# Altium schematic sheet NCS_Wireless_Indicator_leds.SchDoc
size A
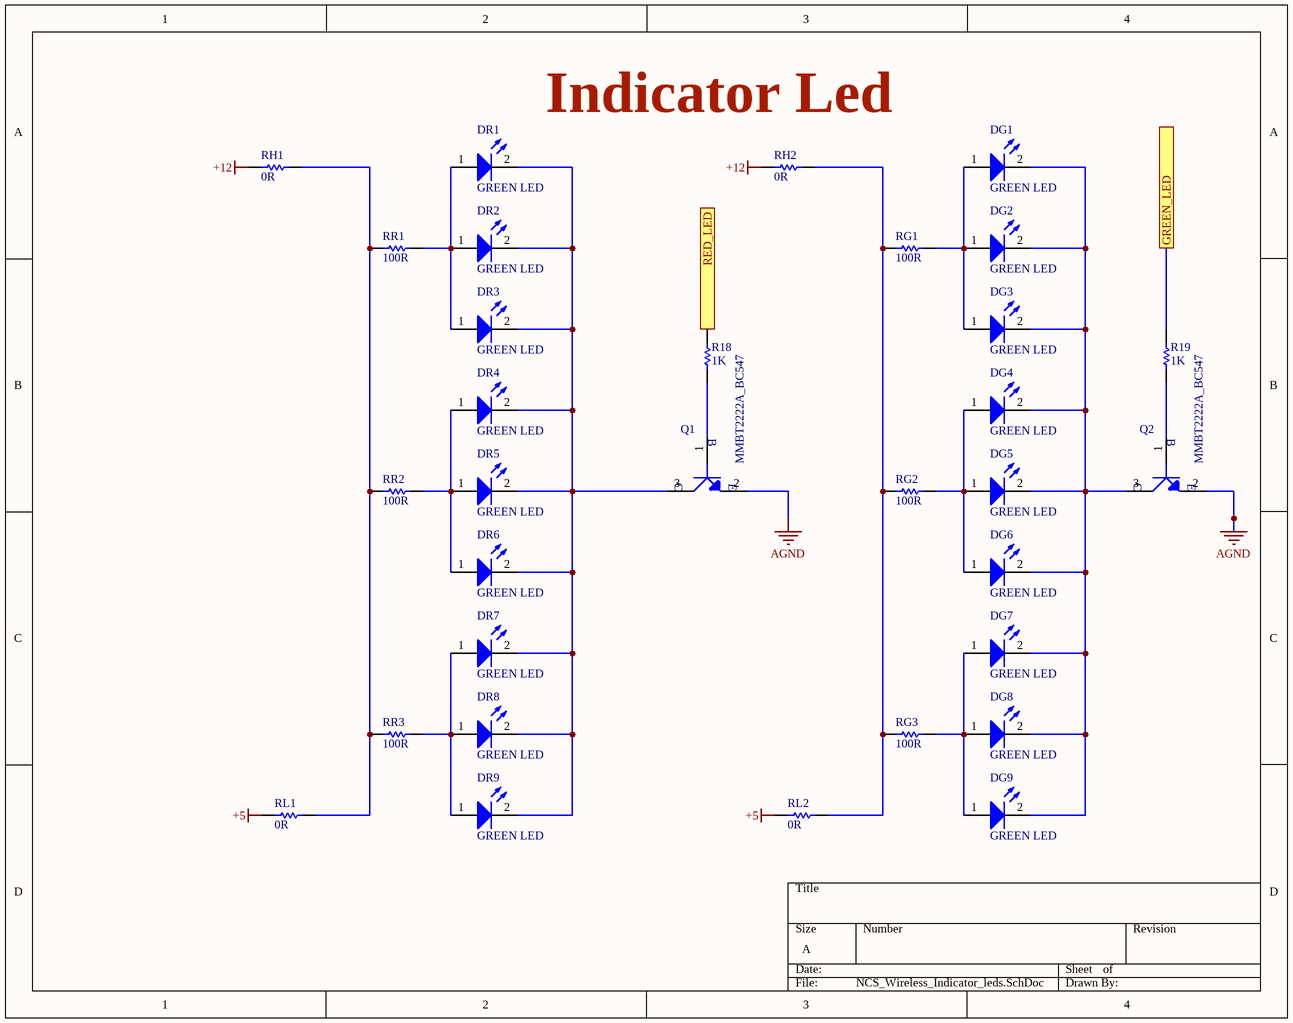
[diagram p0: NCS_Wireless_Indicator_leds.SchDoc]

## Parts
DG1  GREEN LED  [LED_1208]
DG2  GREEN LED  [LED_1208]
DG3  GREEN LED  [LED_1208]
DG4  GREEN LED  [LED_1208]
DG5  GREEN LED  [LED_1208]
DG6  GREEN LED  [LED_1208]
DG7  GREEN LED  [LED_1208]
DG8  GREEN LED  [LED_1208]
DG9  GREEN LED  [LED_1208]
DR1  GREEN LED  [LED_1208]
DR2  GREEN LED  [LED_1208]
DR3  GREEN LED  [LED_1208]
DR4  GREEN LED  [LED_1208]
DR5  GREEN LED  [LED_1208]
DR6  GREEN LED  [LED_1208]
DR7  GREEN LED  [LED_1208]
DR8  GREEN LED  [LED_1208]
DR9  GREEN LED  [LED_1208]
Q1  MMBT2222A_BC547  [MMBT2222A_SOT23]
Q2  MMBT2222A_BC547  [MMBT2222A_SOT23]
R18  1K  [RC0805FR-7W330RL]
R19  1K  [RC0805FR-7W330RL]
RG1  100R  [RC0805FR-7W330RL]
RG2  100R  [RC0805FR-7W330RL]
RG3  100R  [RC0805FR-7W330RL]
RH1  0R  [RC0805FR-7W330RL]
RH2  0R  [RC0805FR-7W330RL]
RL1  0R  [RC0805FR-7W330RL]
RL2  0R  [RC0805FR-7W330RL]
RR1  100R  [RC0805FR-7W330RL]
RR2  100R  [RC0805FR-7W330RL]
RR3  100R  [RC0805FR-7W330RL]

## Ports
GREEN_LED, RED_LED

## Nets
+5: RL1.1 RL2.1
+12: RH1.1 RH2.1
AGND: Q1.2(E) Q2.2(E)
GREEN_LED: R19.2 ; port GREEN_LED
RED_LED: R18.2 ; port RED_LED
NetDG1_1: DG1.1(A) DG2.1(A) DG3.1(A) RG1.2
NetDG1_2: DG1.2(K) DG2.2(K) DG3.2(K) DG4.2(K) DG5.2(K) DG6.2(K) DG7.2(K) DG8.2(K) DG9.2(K) Q2.3(C)
NetDG4_1: DG4.1(A) DG5.1(A) DG6.1(A) RG2.2
NetDG7_1: DG7.1(A) DG8.1(A) DG9.1(A) RG3.2
NetDR1_1: DR1.1(A) DR2.1(A) DR3.1(A) RR1.2
NetDR1_2: DR1.2(K) DR2.2(K) DR3.2(K) DR4.2(K) DR5.2(K) DR6.2(K) DR7.2(K) DR8.2(K) DR9.2(K) Q1.3(C)
NetDR4_1: DR4.1(A) DR5.1(A) DR6.1(A) RR2.2
NetDR7_1: DR7.1(A) DR8.1(A) DR9.1(A) RR3.2
NetQ1_1: Q1.1(B) R18.1
NetQ2_1: Q2.1(B) R19.1
NetRG1_1: RG1.1 RG2.1 RG3.1 RH2.2 RL2.2
NetRH1_2: RH1.2 RL1.2 RR1.1 RR2.1 RR3.1

## Notes on the sheet
- (near RH2) Indicator Led

## Library data of the parts
DG1-DG9 DR1-DR9 = QBLP653-R: LED Uni-Color Red 2-Pin Chip 1208(3020Metric) T/R; Manufacturer: QT-Brightek; Lens Color: Colorless; Lens Style: Round,Domed; Lens Transparency: Clear; Luminous Intensity: 3850mcd; Forward Voltage: 2V; Test Current: 20mA; Viewing Angle: 15°; Dominant Wavelength: 625nm; Lens Size: 1.8mm; Supplier 1: Digikey; Manufacturer Part Number: QBLP653-R; RoHS: Yes; Category: LEDs; Stock 1: 132671; Pricing 1: 1=0.4, 10=0.246, 100=0.1417 (USD); Mount: Surface Mount; Case/Package: 1209; Color: Red; Case Code (Imperial): 1209; Case Code (Metric): 3224; Packaging: Cut Tape; Series: QBLP653; Wavelength: 625nm; Length: 3.2mm; Width: 2.4mm; Height: 2.6mm; RoHS Compliant: Yes; ComponentLink1URL: http://www.qt-brightek.com/datasheet/QBLP653_series.pdf?src-supplier=Digikey; ComponentLink1Description: http://www.qt-brightek.com/datasheet/QBLP653_series.pdf?src-supplier=Digikey; Supplier Part Number 1: 1516-1094-1-ND
Q1 Q2 = MMBT2222A: Trans GP BJT NPN 40V 0.6A 250mW Automotive 3-Pin SOT-23 T/R; Manufacturer: Infineon; Collector Emitter Voltage (VCEO): 10V; Supplier 1: Digikey; Manufacturer Part Number: MMBT2222A; RoHS: Yes; Category: Uncategorized; Case/Package: SOT; Number of Pins: 3; Packaging: Tape and Reel; Polarity: NPN; Voltage: 40V; RoHS Compliant: Yes; Supplier Part Number 1: 2156-MMBT2222A-ND
R18 R19 RG1-RG3 RH1 RH2 RL1 RL2 RR1-RR3 = RC0805FR-7W330RL: Res Thick Film 0805 330 Ohm 1% 0.25W(1/4W) ±200ppm/C Pad SMD T/R; Manufacturer: Yageo; Value: 330R; Supplier: Digikey; Supplier Part Number: 13-RC0805FR-7W330RLCT-ND; Manufacturer Part Number: RC0805FR-7W330RL; RoHS: Yes; Category: Chip SMD Resistors; Stock: 5595; Pricing: 1=0.17, 10=0.057, 50=0.046, 100=0.0347, 500=0.03264, 1000=0.0306 (USD); Case/Package: 339Case; Packaging: 10Packaging